# Altium project Analizador_de_espectro.PrjPcb
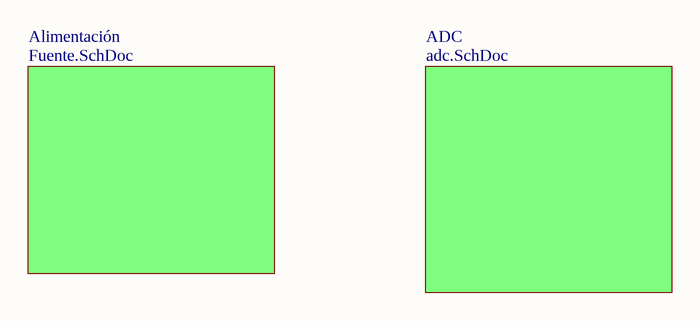
[diagram p0: Analizador_de_espectro.SchDoc]
3 sheets, 22 parts. Net scope: flat (ports and power ports of the same name join across sheets).
Sheets:
  Analizador_de_espectro.SchDoc
    Alimentación = Fuente.SchDoc
    ADC = adc.SchDoc

## Sheet Analizador_de_espectro.SchDoc
size A4

### Sub-sheets
ADC = adc.SchDoc: no entries
Alimentación = Fuente.SchDoc: no entries

## Sheet Fuente.SchDoc
size A4
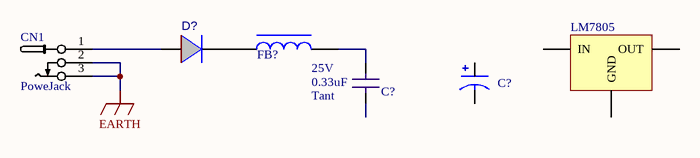
[diagram p1: Fuente.SchDoc]

### Parts
(Parts that share a designator on the sheet are numbered #1, #2 ... from top to bottom, then left to right.)
C?#1  C  [0805]  (value not drawn)
C?#2  C: 0.33uF  V: 25V  Material: Tant  [0805]  (hidden comment: Cap1)
CN1  PoweJack
D?  (no value)  [D_SMA]
FB?  Ferrite Bead  (value not drawn)
LM7805  Regulador  (value not drawn)

### Nets
EARTH: CN1.2 CN1.3
NetC?#2_1: C?#2.1 FB?.2
NetCN1_1: CN1.1 D?.1(A)
NetD?_2: D?.2(K) FB?.1

Not connected (* = marked no-connect by the designer): C?#1 1 2; C?#2 2; LM7805 1(IN) 2(GND) 3(OUT)

### Library data of the parts
C?#1 = Cap_Elec: Capacitor; Material: *; Part number: *
C?#2 = Cap1: Capacitor
CN1 = Barrel_jack
D? = DIODO: Diode signal
LM7805 = LM7805

## Sheet adc.SchDoc
size A3
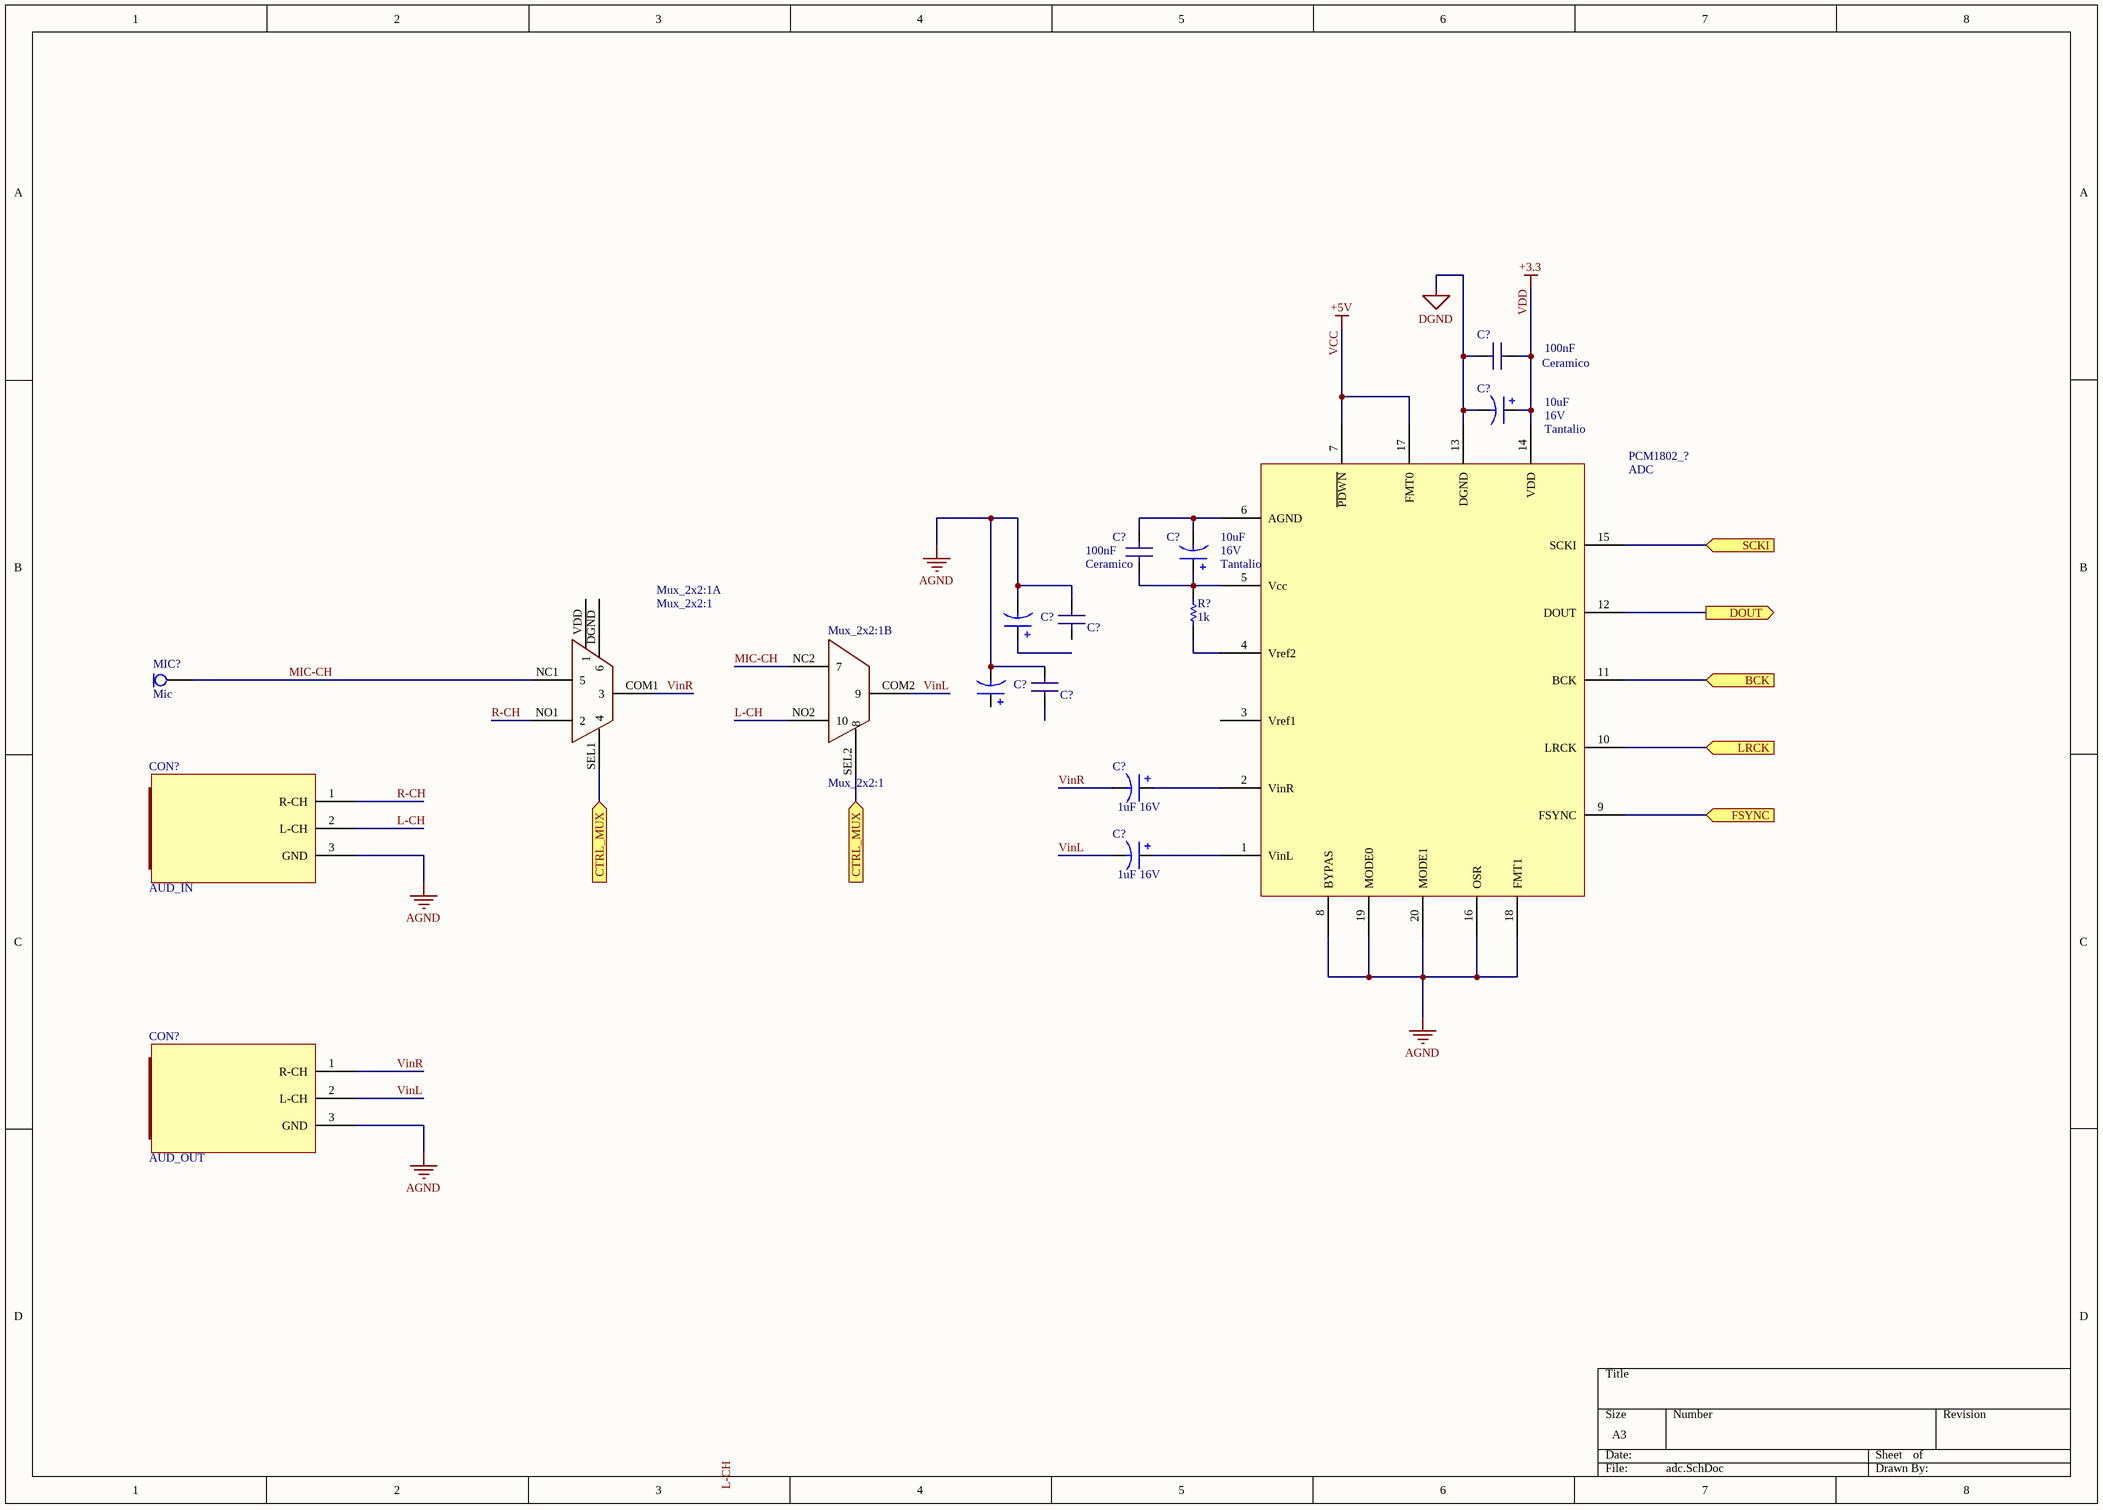
[diagram p2: adc.SchDoc]

### Parts
(Parts that share a designator on the sheet are numbered #1, #2 ... from top to bottom, then left to right.)
C?#3  C: 100nF  [0805]  (hidden comment: Cap1)
C?#4  C: 10uF  V: 16V  Material: Tantalio  [0805]  (hidden comment: C)
C?#5  C: 100nF  [0805]  (hidden comment: Cap1)
C?#6  C: 10uF  V: 16V  Material: Tantalio  [0805]  (hidden comment: C)
C?#7  C  [0805]  (value not drawn)
C?#8  Cap1  [0805]  (value not drawn)
C?#9  C  [0805]  (value not drawn)
C?#10  Cap1  [0805]  (value not drawn)
C?#11  C: 1uF  V: 16V  [0805]  (hidden comment: C)
C?#12  C: 1uF  V: 16V  [0805]  (hidden comment: C)
CON?#1  AUD_IN
CON?#2  AUD_OUT
MIC?  Mic
Mux_2x2:1  Mux_2x2:1  (parts A,B of 2)
PCM1802_?  ADC
R?  value 1k  [0805]  (hidden comment: Res1)

### Ports
BCK (in), CTRL_MUX (in), DOUT (out), FSYNC (in), LRCK (in), SCKI (in)

### Nets
AGND: C?#7.2 C?#8.1 C?#9.2 C?#10.1 CON?#1.3(GND) CON?#2.3(GND) PCM1802_?.8(BYPAS) PCM1802_?.16(OSR) PCM1802_?.18(FMT1) PCM1802_?.19(MODE0) PCM1802_?.20(MODE1)
DGND: C?#3.1 C?#4.2 PCM1802_?.13(DGND)
VCC: PCM1802_?.7(~{PDWN}) PCM1802_?.17(FMT0)  [also labelled +5V]
VDD: C?#3.2 C?#4.1 PCM1802_?.14(VDD)  [also labelled +3.3]
L-CH: CON?#1.2(L-CH) Mux_2x2:1.NO2(10)
MIC-CH: MIC?.1 Mux_2x2:1.NC1(5) Mux_2x2:1.NC2(7)
R-CH: CON?#1.1(R-CH) Mux_2x2:1.NO1(2)
VinL: C?#12.2 CON?#2.2(L-CH) Mux_2x2:1.COM2(9)
VinR: C?#11.2 CON?#2.1(R-CH) Mux_2x2:1.COM1(3)
NetC?#5_1: C?#5.1 C?#6.2 PCM1802_?.6(AGND)
NetC?#5_2: C?#5.2 C?#6.1 PCM1802_?.5(Vcc) R?.2
NetC?#11_1: C?#11.1 PCM1802_?.2(VinR)
NetC?#12_1: C?#12.1 PCM1802_?.1(VinL)
NetMux_2x2:1_SEL1: Mux_2x2:1.SEL1(4) Mux_2x2:1.SEL2(8) ; port CTRL_MUX
NetPCM1802_?_4: PCM1802_?.4(Vref2) R?.1
NetPCM1802_?_9: PCM1802_?.9(FSYNC) ; port FSYNC
NetPCM1802_?_10: PCM1802_?.10(LRCK) ; port LRCK
NetPCM1802_?_11: PCM1802_?.11(BCK) ; port BCK
NetPCM1802_?_12: PCM1802_?.12(DOUT) ; port DOUT
NetPCM1802_?_15: PCM1802_?.15(SCKI) ; port SCKI

Not connected (* = marked no-connect by the designer): C?#7 1; C?#8 2; C?#9 1; C?#10 2; Mux_2x2:1 DGND(6) VDD(1); PCM1802_? 3(Vref1)

### Notes on the sheet
- Labels drawn without touching a wire or pin: L-CH
- (in symbol Cap1) Ceramico

### Library data of the parts
C?#3 C?#5 C?#8 C?#10 = Cap1: Capacitor
  C?#8 C?#10: C: *
C?#4 C?#6 C?#7 C?#9 C?#11 C?#12 = Cap_Elec: Capacitor; Part number: *
  C?#7 C?#9 C?#11 C?#12: Material: *
CON?#1 CON?#2 = Jack_1
MIC? = Mic: Microfono
PCM1802_? = PCM1802
R? = Res1: Resistor